# EAGLE design gpsdo (EAGLE 8.2.2)
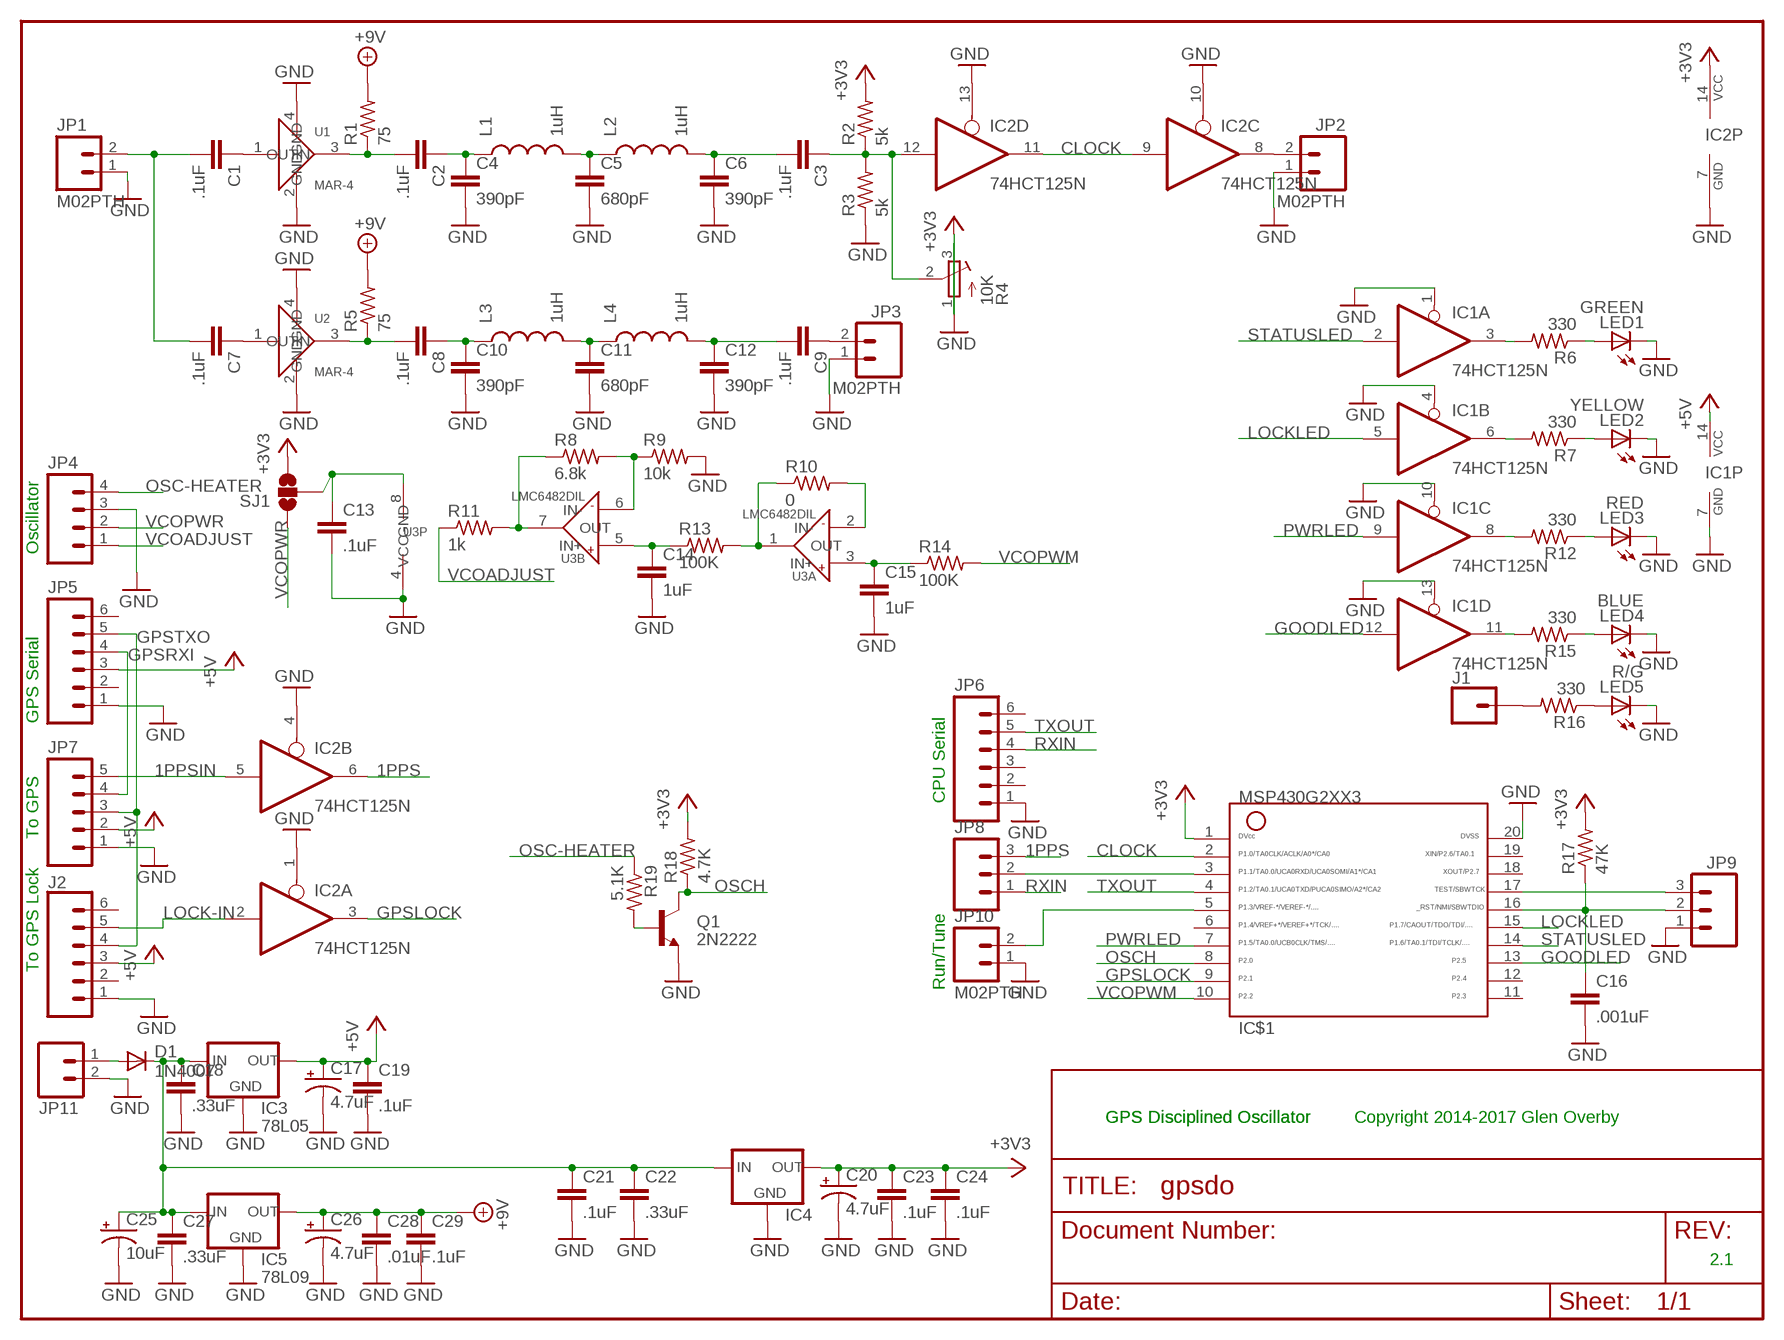
[diagram p0: schematic, sheet 1]

## Parts
C1  .1uF  CAPPTH  [CAP-PTH-SMALL]
C2  .1uF  CAPPTH  [CAP-PTH-SMALL]
C3  .1uF  CAPPTH  [CAP-PTH-SMALL]
C4  390pF  CAPPTH  [CAP-PTH-SMALL]
C5  680pF  CAPPTH  [CAP-PTH-SMALL]
C6  390pF  CAPPTH  [CAP-PTH-SMALL]
C7  .1uF  CAPPTH  [CAP-PTH-SMALL]
C8  .1uF  CAPPTH  [CAP-PTH-SMALL]
C9  .1uF  CAPPTH  [CAP-PTH-SMALL]
C10  390pF  CAPPTH  [CAP-PTH-SMALL]
C11  680pF  CAPPTH  [CAP-PTH-SMALL]
C12  390pF  CAPPTH  [CAP-PTH-SMALL]
C13  .1uF  CAPPTH1  [CAP-PTH-5MM]
C14  1uF  CAPPTH  [CAP-PTH-SMALL]
C15  1uF  CAPPTH  [CAP-PTH-SMALL]
C16  .001uF  CAPPTH  [CAP-PTH-SMALL]
C17  4.7uF  10UF-16V-10%(TANT)  [EIA3216]
C18  .33uF  CAPPTH  [CAP-PTH-SMALL]
C19  .1uF  CAPPTH  [CAP-PTH-SMALL]
C20  4.7uF  10UF-16V-10%(TANT)  [EIA3216]
C21  .1uF  CAPPTH  [CAP-PTH-SMALL]
C22  .33uF  CAPPTH  [CAP-PTH-SMALL]
C23  .1uF  CAPPTH  [CAP-PTH-SMALL]
C24  .1uF  CAPPTH  [CAP-PTH-SMALL]
C25  10uF  CAP_POLPTH2  [CPOL-RADIAL-10UF-25V]
C26  4.7uF  10UF-16V-10%(TANT)  [EIA3216]
C27  .33uF  CAPPTH  [CAP-PTH-SMALL]
C28  .01uF  CAPPTH  [CAP-PTH-SMALL]
C29  .1uF  CAPPTH  [CAP-PTH-SMALL]
D1  1N4007  DIODEPTH  [DIODE-1N4001]
IC1  74HCT125N  [DIL14]
IC2  74HCT125N  74LS125N  [DIL14]
IC3  78L05  V_REG_78XXSINK  [TO220-IGO]
IC4  78LXX  [78LXX]
IC5  78L09  78LXX  [78LXX]
IC$1  G2XX3---N20  [N20]
J1  CONN_01  [1X01]
J2  CONN_06SILK_FEMALE_PTH  [1X06]
JP1  M02PTH  [1X02]
JP2  M02PTH  [1X02]
JP3  M02PTH  [1X02]
JP4  M04PTH  [1X04@1]
JP5  M06SILK_FEMALE_PTH  [1X06@1]
JP6  M06SILK_FEMALE_PTH  [1X06@1]
JP7  M05PTH  [1X05]
JP8  M03PTH  [1X03]
JP9  M03PTH  [1X03]
JP10  M02PTH  [1X02]
JP11  M02PTH  [1X02]
L1  1uH  INDUCTOR1210  [1210]
L2  1uH  INDUCTOR1210  [1210]
L3  1uH  INDUCTOR1210  [1210]
L4  1uH  INDUCTOR1210  [1210]
LED1  GREEN  LED3MM  [LED3MM]
LED2  YELLOW  LED3MM  [LED3MM]
LED3  RED  LED3MM  [LED3MM]
LED4  BLUE  LED3MM  [LED3MM]
LED5  R/G  LED3MM  [LED3MM]
Q1  2N2222  TRANSISTOR_NPNTO92  [TO-92]
R1  75  R-US_0207/2V  [0207/2V]
R2  5k  R-US_0207/2V  [0207/2V]
R3  5k  R-US_0207/2V  [0207/2V]
R4  10K  R-TRIMM3296W  [RTRIM3296W]
R5  75  R-US_0207/2V  [0207/2V]
R6  330  R-US_0207/2V  [0207/2V]
R7  330  R-US_0207/2V  [0207/2V]
R8  6.8k  R-US_0207/2V  [0207/2V]
R9  10k  R-US_0207/2V  [0207/2V]
R10  0  R-US_0207/2V  [0207/2V]
R11  1k  R-US_0207/2V  [0207/2V]
R12  330  R-US_0207/2V  [0207/2V]
R13  100K  R-US_0207/2V  [0207/2V]
R14  100K  R-US_0207/2V  [0207/2V]
R15  330  R-US_0207/2V  [0207/2V]
R16  330  R-US_0207/2V  [0207/2V]
R17  47K  R-US_0207/2V  [0207/2V]
R18  4.7K  R-US_0207/2V  [0207/2V]
R19  5.1K  R-US_0207/2V  [0207/2V]
SJ1  SOLDERJUMPER_2WAYW  [SJ_2W]
U1  MAR-4  [VV105]
U2  MAR-4  [VV105]
U3  LMC6482DIL  [DIL08]

## Nets
1PPS: IC2.6(B:O) JP8.3
1PPSIN: IC2.5(B:I) JP7.5
+3V3: C20.A(+) C23.1 C24.1 IC2.14(P:VCC) IC4.OUT IC$1.1 R2.2 R4.1(A) R17.2 R18.2 SJ1.3
+5V: C17.A(+) C19.1 IC1.14(P:VCC) IC3.OUT J2.3 JP5.3 JP7.2
+9V: C26.A(+) C28.1 C29.1 IC5.OUT R1.2 R5.2
CLOCK: IC2.9(C:I) IC2.11(D:O) IC$1.2
GND: C4.2 C5.2 C6.2 C10.2 C11.2 C12.2 C13.2 C14.2 C15.2 C16.2 C17.C(-) C18.2 C19.2 C20.C(-) C21.2 C22.2 C23.2 C24.2 C25.2(-) C26.C(-) C27.2 C28.2 C29.2 IC1.1(A:OE) IC1.4(B:OE) IC1.7(P:GND) IC1.10(C:OE) IC1.13(D:OE) IC2.1(A:OE) IC2.4(B:OE) IC2.7(P:GND) IC2.10(C:OE) IC2.13(D:OE) IC3.GND IC4.GND IC5.GND IC$1.20 J2.1 JP1.1 JP2.1 JP3.1 JP4.3 JP5.1 JP6.1 JP7.1 JP9.1 JP10.1 JP11.2 LED1.K(C) LED2.K(C) LED3.K(C) LED4.K(C) LED5.K(C) Q1.1(E) R3.1 R4.3(E) R9.2 U1.2(GND) U1.4(GND) U2.2(GND) U2.4(GND) U3.4(P:GND)
GOODLED: IC1.12(D:I) IC$1.13
GPSLOCK: IC2.3(A:O) IC$1.9
GPSRXI: JP5.4 JP7.4
GPSTXO: J2.4 JP5.5 JP7.3
LOCK-IN: IC2.2(A:I) J2.5
LOCKLED: IC1.5(B:I) IC$1.15
N$1: LED2.A R7.1
N$2: C5.1 L1.2 L2.1
N$3: C3.2 C6.1 L2.2
N$4: C1.1 U1.1(IN)
N$5: C14.1 R13.1 U3.5(B:IN+)
N$6: R10.1 R13.2 U3.1(A:OUT)
N$7: C15.1 R14.1 U3.3(A:IN+)
N$9: IC$1.3 JP8.2
N$10: C2.2 R1.1 U1.3(OUT)
N$11: C3.1 IC2.12(D:I) R2.1 R3.2 R4.2(S)
N$12: LED1.A R6.1
N$13: R8.1 R11.2 U3.7(B:OUT)
N$14: C1.2 C7.2 JP1.2
N$15: R10.2 U3.2(A:IN-)
N$16: C11.1 L3.2 L4.1
N$17: D1.A JP11.1
N$18: C9.2 C12.1 L4.2
N$19: IC$1.5 JP10.2
N$20: IC1.8(C:O) R12.2
N$21: IC1.11(D:O) R15.2
N$22: C8.2 R5.1 U2.3(OUT)
N$23: C16.1 IC$1.16 JP9.2 R17.1
N$24: C8.1 C10.1 L3.1
N$25: C7.1 U2.1(IN)
N$26: C9.1 JP3.2
N$27: IC$1.17 JP9.3
N$28: LED5.A R16.1
N$29: J1.1 R16.2
N$30: IC2.8(C:O) JP2.2
N$31: C13.1 SJ1.2 U3.8(P:VCC)
N$33: C2.1 C4.1 L1.1
N$35: IC1.3(A:O) R6.2
N$36: IC1.6(B:O) R7.2
N$37: R8.2 R9.1 U3.6(B:IN-)
N$39: LED3.A R12.1
N$40: LED4.A R15.1
N$41: Q1.2(B) R19.2
OSC-HEATER: JP4.4 R19.1
OSCH: IC$1.8 Q1.3(C) R18.1
PWRIN: C18.1 C21.1 C22.1 C25.1(+) C27.1 D1.C IC3.IN IC4.IN IC5.IN
PWRLED: IC1.9(C:I) IC$1.7
RXIN: JP6.4 JP8.1
STATUSLED: IC1.2(A:I) IC$1.14
TXOUT: IC$1.4 JP6.5
VCOADJUST: JP4.1 R11.1
VCOPWM: IC$1.10 R14.2
VCOPWR: JP4.2 SJ1.1
Unconnected: IC$1.6 IC$1.11 IC$1.12 IC$1.18 IC$1.19 J2.2 J2.6 JP5.2 JP5.6 JP6.2 JP6.3 JP6.6

## Notes on the sheet
- Oscillator
- GPS Serial
- CPU Serial
- To GPS
- To GPS Lock
- Run/Tune
- GPS Disciplined Oscillator | GPS Disciplined Oscillator | Copyright 2014-2017 Glen Overby
- 2.1

## Library data of the parts
C1-C3 C7-C9 = SparkFun:CAP: Capacitor Standard 0603 ceramic capacitor, and 0.1" leaded capacitor.
C4-C6 C10-C12 = zener:CAP: Capacitor Standard 0603 ceramic capacitor, and 0.1" leaded capacitor.
C13 C16 C18 C19 C21-C24 C27-C29 = SparkFun-Capacitors:CAP: Capacitor Standard 0603 ceramic capacitor, and 0.1" leaded capacitor.
C14 C15 = SparkFun-Passives:CAP: Capacitor Standard 0603 ceramic capacitor, and 0.1" leaded capacitor.
C17 C20 C26 = SparkFun-Capacitors:10UF-16V-10%(TANT): CAP-00811 1206/EIA-3216 Tantalum capacitor; PROD_ID: CAP-00811; VALUE: 10uF
C25 = SparkFun-Passives:CAP_POL: Capacitor Polarized These are standard SMD and PTH capacitors. Normally 10uF, 47uF, and 100uF in electrolytic and tantalum varieties. Always verify the external diameter of the through hole cap, it varies with capacity, voltage, and manufacturer. The EIA devices should be standard.
D1 = SparkFun:DIODE: Diode These are standard reverse protection diodes and small signal diodes. SMA package can handle up to about 1A. SOD-323 can handle about 200mA. What the SOD-323 package when ordering, there are some mfgs out there that are 5-pin packages.
IC1 = 74xx-eu:74*125: Quad bus BUFFER, 3-state
IC2 = 74xx-us:74*125: Quad bus BUFFER, 3-state
IC3 = SparkFun:V_REG_78XX: Voltage Regulator Standard 7805 5V regulator. IGO (Input Ground Output). Spark Fun Electronics SKU : COM-00107
IC4 IC5 = v-reg:78LXX: VOLTAGE REGULATOR
IC$1 = TI_MSP430_v16:G2XX3---N20: MSP430G2XX1 PDIP (N) 20 Pin Package
J1 = SparkFun-Connectors:CONN_01: Single connection point. Often used as Generic Header-pin footprint for 0.1 inch spaced/style header connections On any of the 0.1 inch spaced packages, you can populate with these: Break Away Headers - Straight <https://www.sparkfun.com/products/116> (PRT-00116) Break Away Male Headers - Right Angle <https://www.sparkfun.com/products/553> (PRT-00553) Female Headers <https://www.sparkfun.com/products/115> (PRT-00115) Break Away Headers - Machine Pin <https://www.sparkfun.com/products/117> (PRT-00117) Break Away Female Headers - Swiss Machine Pin <https://www.sparkfun.com/products/743> (PRT-00743) This device is also useful as a general connection point to wire up your design to another part of your project. Our various solder wires solder well into these plated through hole pads. Hook-Up Wire - Assortment (Stranded, 22 AWG) <https://www.sparkfun.com/products/11375> (PRT-11375) Hook-Up Wire - Assortment (Solid Core, 22 AWG) <https://www.sparkfun.com/products/11367> (PRT-11367) View the entire wire category on our website here <https://www.sparkfun.com/categories/141> Special notes: SMTSO-256-ET is a "flush mount" nut for a 4-40 screw. We mostly use this on specialty testbeds; it is a nice way to connect hardware to your PCB at an adjustable hieght. Also note, the SNAP packages are for using a snappable style connector. We sell a baggie of snaps and they are also used on two LilyPad designs: Snap Assortment - 30 pack (male and female) <https://www.sparkfun.com/products/11347> (DEV-11347) LilyPad Arduino SimpleSnap <https://www.sparkfun.com/products/10941> (DEV-10941) LilyPad SimpleSnap Protoboard <https://www.sparkfun.com/products/10940> (DEV-10940)
J2 = SparkFun-Connectors:CONN_06: Multi connection point. Often used as Generic Header-pin footprint for 0.1 inch spaced/style header connections On any of the 0.1 inch spaced packages, you can populate with these: Break Away Headers - Straight <https://www.sparkfun.com/products/116> (PRT-00116) Break Away Male Headers - Right Angle <https://www.sparkfun.com/products/553> (PRT-00553) Female Headers <https://www.sparkfun.com/products/115> (PRT-00115) Break Away Headers - Machine Pin <https://www.sparkfun.com/products/117> (PRT-00117) Break Away Female Headers - Swiss Machine Pin <https://www.sparkfun.com/products/743> (PRT-00743) Arduino Stackable Header - 6 Pin <https://www.sparkfun.com/products/9280> (PRT-09280) For SCREWTERMINALS and SPRING TERMINALS visit here: Screw Terimnals on SparkFun.com <https://www.sparkfun.com/search/results?term=Screw+Terminals> (5mm/3.5mm/2.54mm spacing) This device is also useful as a general connection point to wire up your design to another part of your project. Our various solder wires solder well into these plated through hole pads. Hook-Up Wire - Assortment (Stranded, 22 AWG) <https://www.sparkfun.com/products/11375> (PRT-11375) Hook-Up Wire - Assortment (Solid Core, 22 AWG) <https://www.sparkfun.com/products/11367> (PRT-11367) View the entire wire category on our website here <https://www.sparkfun.com/categories/141>; PROD_ID: CONN-08437
JP1-JP3 JP10 = SparkFun-Connectors:M02: Standard 2-pin 0.1" header. Use with - straight break away headers ( PRT-00116) - right angle break away headers (PRT-00553) - swiss pins (PRT-00743) - machine pins (PRT-00117) - female headers (PRT-00115) Molex polarized connector foot print use with: PRT-08233 with associated crimp pins and housings. 2.54_SCREWTERM for use with PRT-10571. 3.5mm Screw Terminal footprints for PRT-08084 5mm Screw Terminal footprints for use with PRT-08432
JP4 = SparkFun-Connectors:M04: Header 4 Standard 4-pin 0.1" header. Use with straight break away headers (SKU : PRT-00116), right angle break away headers (PRT-00553), swiss pins (PRT-00743), machine pins (PRT-00117), and female headers (PRT-00115). Molex polarized connector foot print use with SKU : PRT-08231 with associated crimp pins and housings. 1MM SMD Version SKU: PRT-10208
JP5 JP6 = SparkFun-Connectors:M06: Header 6 Standard 6-pin 0.1" header. Use with straight break away headers (SKU : PRT-00116), right angle break away headers (PRT-00553), swiss pins (PRT-00743), machine pins (PRT-00117), and female headers (PRT-00115). Molex polarized connector foot print use with SKU : PRT-08094 with associated crimp pins and housings. NOTES ON THE VARIANTS LOCK and LOCK_LONGPADS... This footprint was designed to help hold the alignment of a through-hole component (i.e. 6-pin header) while soldering it into place. You may notice that each hole has been shifted either up or down by 0.005 of an inch from it's more standard position (which is a perfectly straight line). This slight alteration caused the pins (the squares in the middle) to touch the edges of the holes. Because they are alternating, it causes a "brace" to hold the component in place. 0.005 has proven to be the perfect amount of "off-center" position when using our standard breakaway headers. Although looks a little odd when you look at the bare footprint, once you have a header in there, the alteration is very hard to notice. Also,if you push a header all the way into place, it is covered up entirely on the bottom side. This idea of altering the position of holes to aid alignment will be further integrated into the Sparkfun Library for other footprints. It can help hold any component with 3 or more connection pins.; PROD_ID: CONN-08437
JP7 = SparkFun:M05: Header 5 Standard 5-pin 0.1" header. Use with straight break away headers (SKU : PRT-00116), right angle break away headers (PRT-00553), swiss pins (PRT-00743), machine pins (PRT-00117), and female headers (PRT-00115). Molex polarized connector foot print use with SKU : PRT-08230 with associated crimp pins and housings.
JP8 JP9 = SparkFun:M03: Header 3 Standard 3-pin 0.1" header. Use with straight break away headers (SKU : PRT-00116), right angle break away headers (PRT-00553), swiss pins (PRT-00743), machine pins (PRT-00117), and female headers (PRT-00115). Molex polarized connector foot print use with SKU : PRT-08232 with associated crimp pins and housings.
JP11 = SparkFun:M02: Header 2 Standard 2-pin 0.1" header. Use with straight break away headers (SKU : PRT-00116), right angle break away headers (PRT-00553), swiss pins (PRT-00743), machine pins (PRT-00117), and female headers (PRT-00115). Molex polarized connector foot print use with SKU : PRT-08233 with associated crimp pins and housings.
L1-L4 = SparkFun-Passives:INDUCTOR: Inductors Basic Inductor/Choke - 0603 and 1206. Footprints are not proven and vary greatly between part numbers. SRN6045- 33uH, 20% 1.4A SDR0403-560KL - 56uH, 10%, 500mA RMS/740mA peak
LED1-LED5 = led:LED: LED OSRAM: - CHIPLED LG R971, LG N971, LY N971, LG Q971, LY Q971, LO R971, LY R971 LH N974, LH R974 LS Q976, LO Q976, LY Q976 LO Q996 - Hyper CHIPLED LW Q18S LB Q993, LB Q99A, LB R99A - SideLED LS A670, LO A670, LY A670, LG A670, LP A670 LB A673, LV A673, LT A673, LW A673 LH A674 LY A675 LS A676, LA A676, LO A676, LY A676, LW A676 LS A679, LY A679, LG A679 - Hyper Micro SIDELED® LS Y876, LA Y876, LO Y876, LY Y876 LT Y87S - SmartLED LW L88C, LW L88S LB L89C, LB L89S, LG L890 LS L89K, LO L89K, LY L89K LS L896, LA L896, LO L896, LY L896 - TOPLED LS T670, LO T670, LY T670, LG T670, LP T670 LSG T670, LSP T670, LSY T670, LOP T670, LYG T670 LG T671, LOG T671, LSG T671 LB T673, LV T673, LT T673, LW T673 LH T674 LS T676, LA T676, LO T676, LY T676, LB T676, LH T676, LSB T676, LW T676 LB T67C, LV T67C, LT T67C, LS T67K, LO T67K, LY T67K, LW E67C LS E67B, LA E67B, LO E67B, LY E67B, LB E67C, LV E67C, LT E67C LW T67C LS T679, LY T679, LG T679 LS T770, LO T770, LY T770, LG T770, LP T770 LB T773, LV T773, LT T773, LW T773 LH T774 LS E675, LA E675, LY E675, LS T675 LS T776, LA T776, LO T776, LY T776, LB T776 LHGB T686 LT T68C, LB T68C - Hyper Mini TOPLED® LB M676 - Mini TOPLED Santana® LG M470 LS M47K, LO M47K, LY M47K Source: http://www.osram.convergy.de LUXEON: - LUMILED® LXK2-PW12-R00, LXK2-PW12-S00, LXK2-PW14-U00, LXK2-PW14-V00 LXK2-PM12-R00, LXK2-PM12-S00, LXK2-PM14-U00 LXK2-PE12-Q00, LXK2-PE12-R00, LXK2-PE12-S00, LXK2-PE14-T00, LXK2-PE14-U00 LXK2-PB12-K00, LXK2-PB12-L00, LXK2-PB12-M00, LXK2-PB14-N00, LXK2-PB14-P00, LXK2-PB14-Q00 LXK2-PR12-L00, LXK2-PR12-M00, LXK2-PR14-Q00, LXK2-PR14-R00 LXK2-PD12-Q00, LXK2-PD12-R00, LXK2-PD12-S00 LXK2-PH12-R00, LXK2-PH12-S00 LXK2-PL12-P00, LXK2-PL12-Q00, LXK2-PL12-R00 Source: www.luxeon.com KINGBRIGHT: KA-3528ASYC Source: www.kingbright.com
Q1 = SparkFun:TRANSISTOR_NPN: Transistor NPN BJT configuration in SOT23 package. MMBT2222 is the common NPN we use. Double check BCE configuration again layout.
R1-R3 R5-R19 = resistor:R-US_: RESISTOR, American symbol
R4 = resistor:R-TRIMM: Trimm resistor
SJ1 = SparkFun-Passives:SOLDERJUMPER_2WAY: Solder Jumper 2 way solder jumper
U1 U2 = LTC3200:MAR-4: MAR-4 is a MMIC with 8dB of gain to 1GHZ
U3 = overby:LMC6482: Dual Op-Amp

## Board
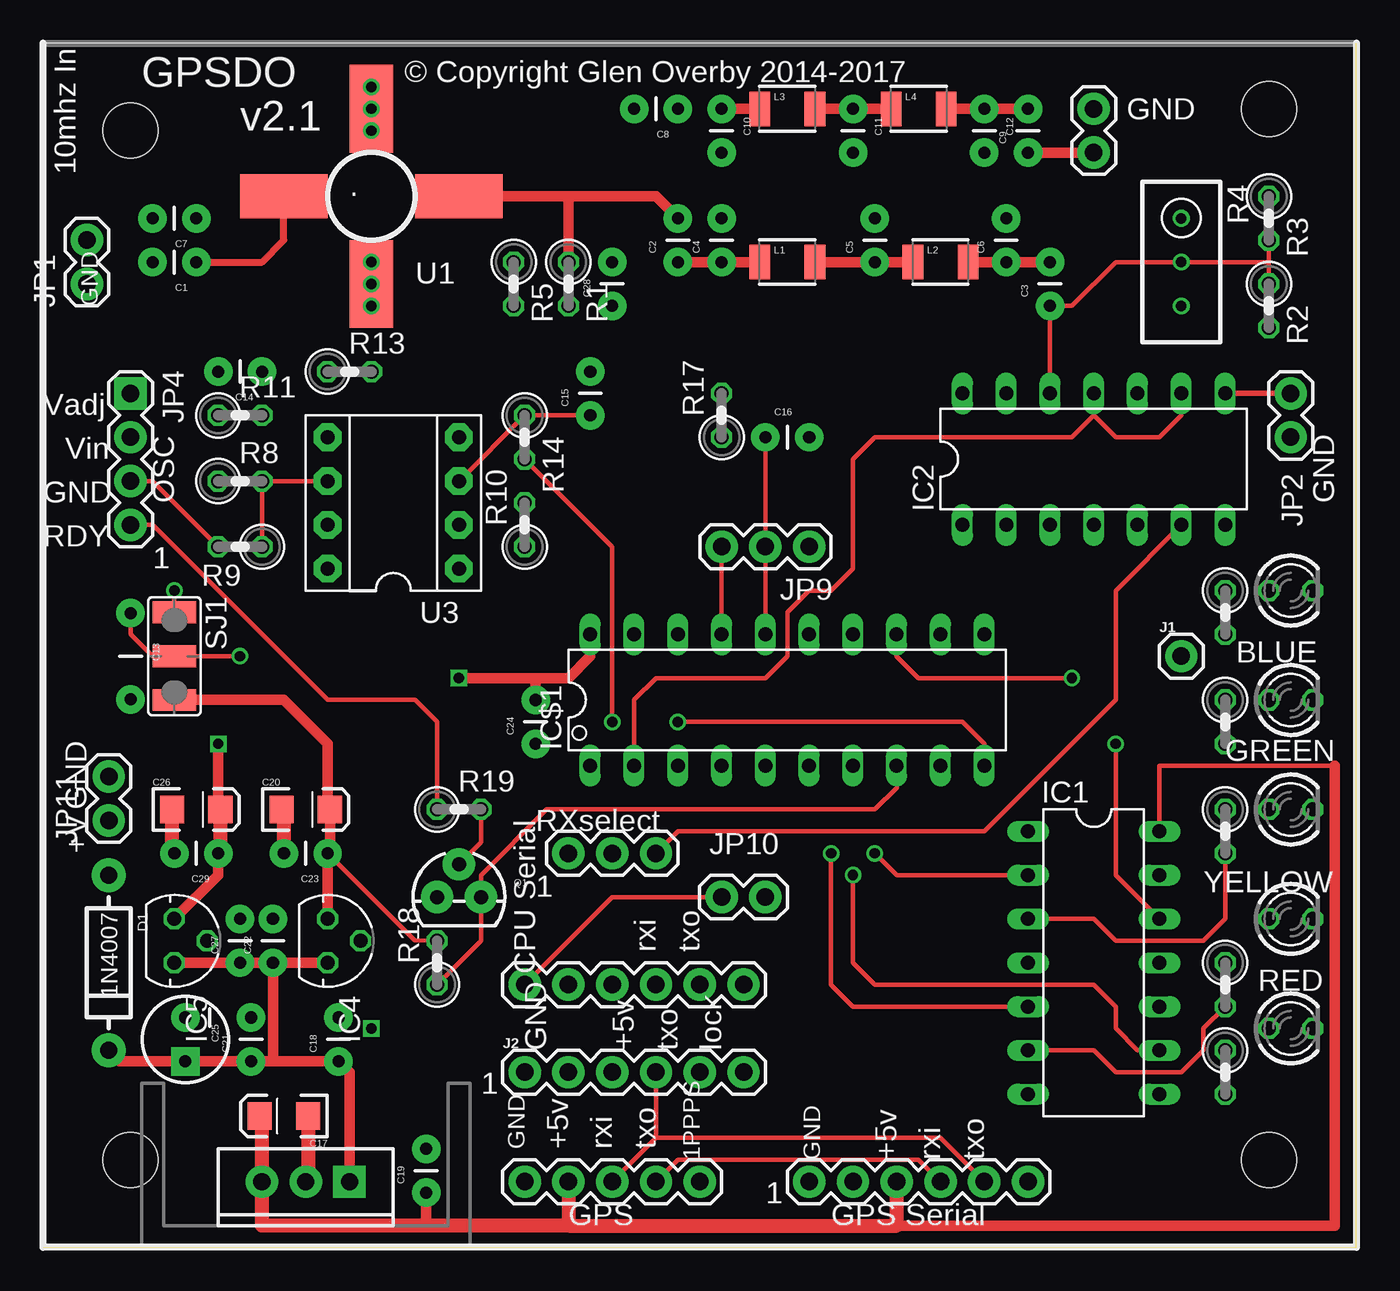
[diagram p1: board, top side]
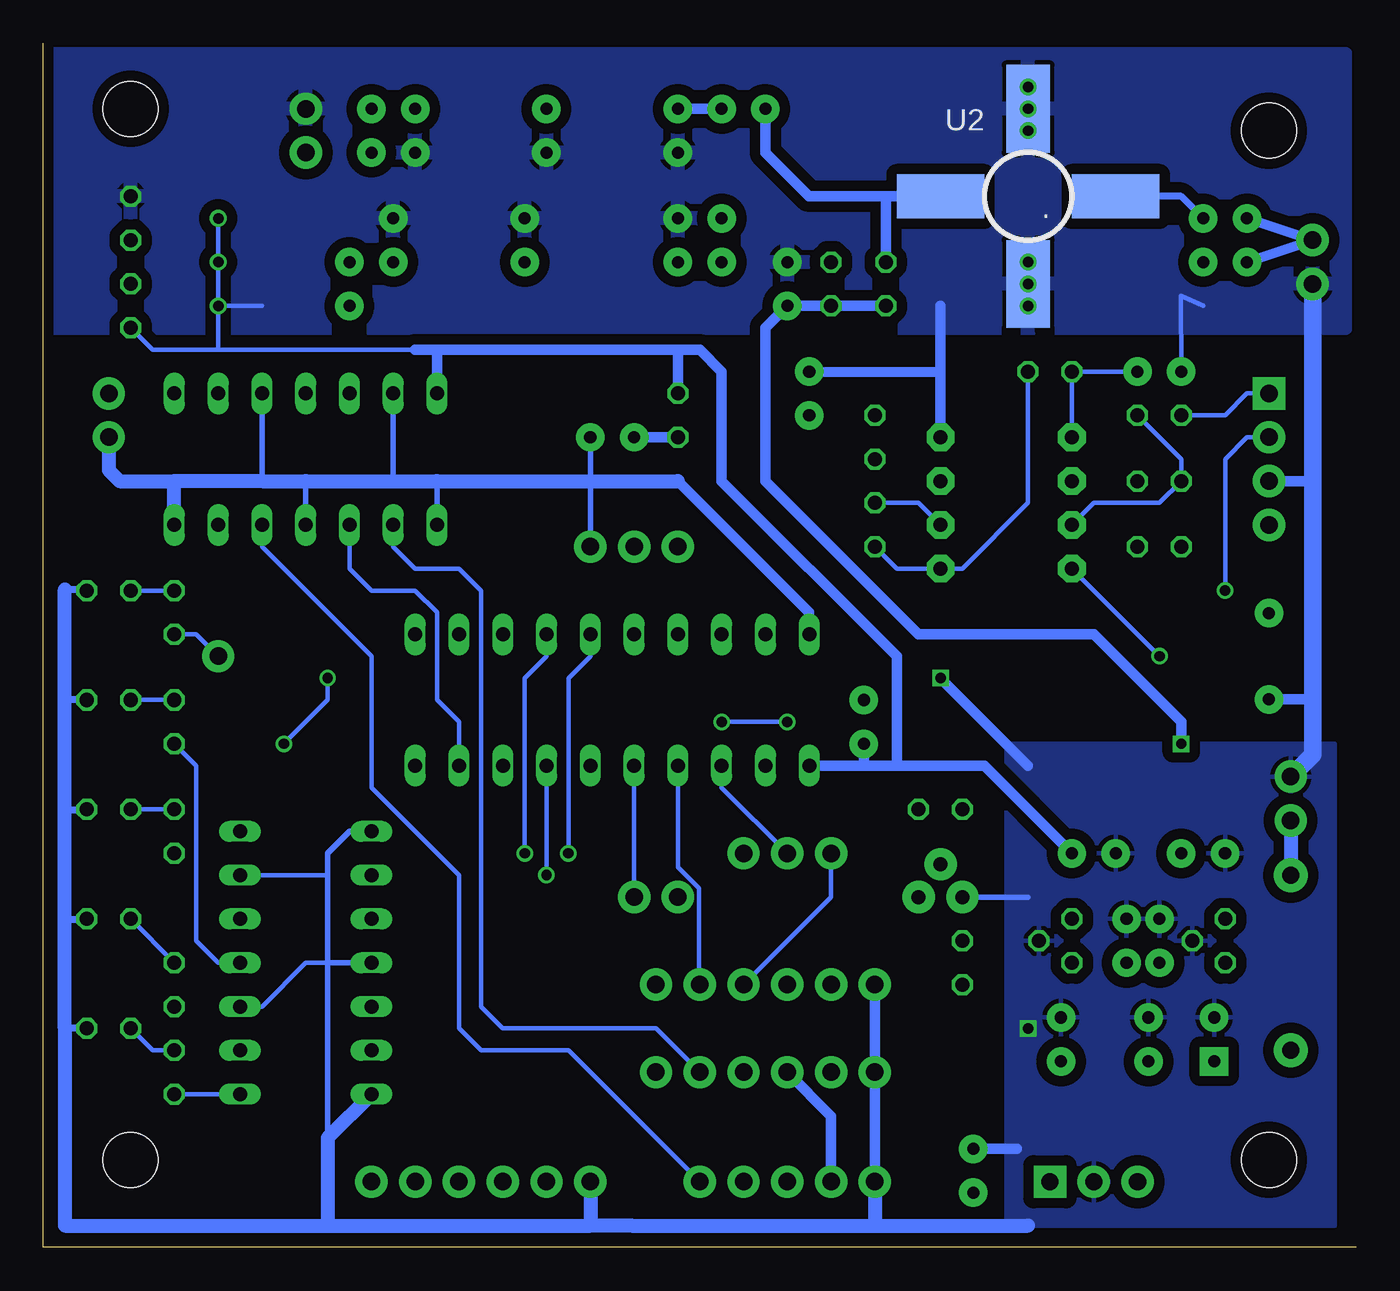
[diagram p2: board, bottom side, seen from below]

Size 76.2 x 69.85 mm. Coordinates in mm from the lower left corner, seen from the top.
Outline: 0,0 76.2,0 76.2,69.85
Copper layers (1*16): Top 0.0356mm / dielectric 1.5011mm / Bottom 0.0356mm
Design rules "LaenPCBOrder": minimum track width 6mil, minimum drill 13mil, track to track 6mil, track to pad 6mil, pad to pad 6mil, via to via 6mil, smd to smd 6mil, copper to edge 15mil, drill to drill 6mil, minimum pad ring 7mil, minimum via ring 7mil, stop-mask expansion 3mil, vias tented up to drill 0mil, thermal gap 10mil
Holes 3.17 mm at 71.12,66.04 5.08,5.08 71.12,5.08 5.08,64.77

### Footprints (pad centres in the part's own frame; a part is rotated, then mirrored left to right if it is on the bottom)
CAP-PTH-SMALL = drill 0.7 pad 1.651: 1 0,0; 2 2.54,0
CAP-PTH-5MM = drill 0.7 pad 1.651: 1 -2.5,0; 2 2.5,0
EIA3216 = smd 1.4 x 1.6: A 1.4,0; C -1.4,0
CPOL-RADIAL-10UF-25V = drill 0.7 pad 1.651 square: 1 1.27,0 | drill 0.7 pad 1.651: 2 -1.27,0
DIODE-1N4001 = drill 1 pad 1.981: A -5.08,0; C 5.08,0
DIL14 = drill 0.813 long: 1 -7.62,-3.81; 2 -5.08,-3.81; 3 -2.54,-3.81; 4 0,-3.81; 5 2.54,-3.81; 6 5.08,-3.81; 7 7.62,-3.81; 8 7.62,3.81; 9 5.08,3.81; 10 2.54,3.81; 11 0,3.81; 12 -2.54,3.81; 13 -5.08,3.81; 14 -7.62,3.81
TO220-IGO = drill 1 pad 1.88: GND 0,0; OUT 2.54,0 | drill 1 pad 1.88 square: IN -2.54,0
78LXX = drill 0.813 octagon: GND 0,1.905; IN 1.27,0; OUT -1.27,0
N20 = drill 0.813 long: 1 -11.435,-3.81; 2 -8.895,-3.81; 3 -6.355,-3.81; 4 -3.815,-3.81; 5 -1.275,-3.81; 6 1.265,-3.81; 7 3.805,-3.81; 8 6.345,-3.81; 9 8.885,-3.81; 10 11.425,-3.81; 11 11.425,3.81; 12 8.885,3.81; 13 6.345,3.81; 14 3.805,3.81; 15 1.265,3.81; 16 -1.275,3.81; 17 -3.815,3.81; 18 -6.355,3.81; 19 -8.895,3.81; 20 -11.435,3.81
1X01 = drill 1.016 pad 1.88: 1 0,0
1X06 = drill 1.016 pad 1.88: 1 0,0; 2 2.54,0; 3 5.08,0; 4 7.62,0; 5 10.16,0; 6 12.7,0
1X02 = drill 1.016 pad 1.88: 1 0,0; 2 2.54,0
1X04@1 = drill 1.016 pad 1.88 square: 1 0,0 | drill 1.016 pad 1.88: 2 2.54,0; 3 5.08,0; 4 7.62,0
1X06@1 = drill 1.016 pad 1.88: 1 0,0; 2 2.54,0; 3 5.08,0; 4 7.62,0; 5 10.16,0; 6 12.7,0
1X05 = drill 1.016 pad 1.88: 1 0,0; 2 2.54,0; 3 5.08,0; 4 7.62,0; 5 10.16,0
1X03 = drill 1.016 pad 1.88: 1 0,0; 2 2.54,0; 3 5.08,0
1210 = smd 1.2 x 2: 1 -1.6,0; 2 1.6,0
LED3MM = drill 0.813 octagon: A -1.27,0; K 1.27,0
TO-92 = drill 0.813 pad 1.88: 1 -1.27,0; 2 0,1.905; 3 1.27,0
0207/2V = drill 0.813 octagon: 1 -1.27,0; 2 1.27,0
RTRIM3296W = drill 0.61: 1 0,-2.54; 2 0,0; 3 0,2.54
SJ_2W = smd 1.27 x 2.54: 1 -2.54,0; 2 0,0; 3 2.54,0
VV105 = smd 5.08 x 2.54: 1 -5.08,0; 3 5.08,0 | smd 2.54 x 5.08: 2 0,-5.08; 4 0,5.08
DIL08 = drill 0.813 pad 1.6 octagon: 1 -3.81,-3.81; 2 -1.27,-3.81; 3 1.27,-3.81; 4 3.81,-3.81; 5 3.81,3.81; 6 1.27,3.81; 7 -1.27,3.81; 8 -3.81,3.81

### Placement (x,y rotation side)
C1  8.89,57.15 180 top
C2  36.83,57.15 90 top
C3  58.42,54.61 90 top
C4  39.37,57.15 90 top
C5  48.26,57.15 90 top
C6  55.88,57.15 90 top
C7  8.89,59.69 180 top
C8  36.83,66.04 180 top
C9  57.15,63.5 90 top
C10  39.37,66.04 270 top
C11  46.99,66.04 270 top
C12  54.61,66.04 270 top
C13  5.08,34.29 270 top
C14  12.7,50.8 180 top
C15  31.75,48.26 90 top
C16  41.91,46.99 0 top
C17  13.97,7.62 180 top
C18  17.14,10.79 90 top
C19  22.23,3.17 90 top
C20  15.24,25.4 0 top
C21  12.06,10.79 90 top
C22  13.34,16.51 90 top
C23  16.51,22.86 180 top
C24  28.57,29.21 90 top
C25  8.26,12.06 270 top
C26  8.89,25.4 0 top
C27  11.43,16.51 90 top
C28  33.02,54.61 90 top
C29  10.16,22.86 180 top
D1  3.81,16.51 270 top
IC1  60.96,16.51 270 top
IC2  60.96,45.72 0 top
IC3  15.24,3.81 180 top
IC4  16.51,17.78 270 top
IC5  7.62,17.78 270 top
IC$1  43.18,31.75 0 top
J1  66.04,34.29 0 top
J2  27.94,10.16 0 top
JP1  2.54,55.88 90 top
JP2  72.39,46.99 90 top
JP3  60.96,66.04 270 top
JP4  5.08,49.53 270 top
JP5  44.45,3.81 0 top
JP6  27.94,15.24 0 top
JP7  27.94,3.81 0 top
JP8  30.48,22.86 0 top
JP9  44.45,40.64 180 top
JP10  39.37,20.32 0 top
JP11  3.81,24.77 90 top
L1  43.18,57.15 0 top
L2  52.07,57.15 0 top
L3  43.18,66.04 0 top
L4  50.8,66.04 0 top
LED1  72.39,25.4 0 top
LED2  72.39,19.05 0 top
LED3  72.39,12.7 0 top
LED4  72.39,31.75 0 top
LED5  72.39,38.1 0 top
Q1  24.13,20.32 0 top
R1  30.48,55.88 270 top
R2  71.12,54.61 270 top
R3  71.12,59.69 270 top
R4  66.04,57.15 180 top
R5  27.3,55.88 270 top
R6  68.58,24.13 270 top
R7  68.58,15.24 270 top
R8  11.43,44.45 0 top
R9  11.43,40.64 180 top
R10  27.94,41.91 90 top
R11  11.43,48.26 0 top
R12  68.58,10.16 270 top
R13  17.78,50.8 0 top
R14  27.94,46.99 270 top
R15  68.58,30.48 270 top
R16  68.58,36.83 270 top
R17  39.37,48.26 90 top
R18  22.86,16.51 90 top
R19  24.13,25.4 0 top
SJ1  7.62,34.29 270 top
U1  19.05,60.96 0 top
U2  19.05,60.96 180 bottom
U3  20.32,43.18 90 top

### Tracks (layer width: path | path; a pad name or v marks a point on that pad's centre or on a via)
1PPS
  Top 0.254: JP8.3 36.83,24.13 54.61,24.13 62.23,31.75 62.23,38.1 IC2.6
1PPSIN
  Bottom 0.254: IC2.5 63.5,40.64 57.15,34.29 57.15,26.67 52.07,21.59 52.07,12.7 50.8,11.43 45.72,11.43 JP7.5
+3V3
  Top 0.254: R18.2 21.59,17.82 21.55,17.82 C23.1
  Top 0.61: SJ1.3 13.97,31.75 16.51,29.21 16.51,25.4 C20.A 16.64,22.99 C23.1 IC4.OUT
  Bottom 0.254: 54.61,52.07 66.04,52.07 | 66.04,52.07 69.85,52.07 R2.2 | R4.1 66.04,52.07
  Bottom 0.61: IC$1.1 28.57,27.94 | 28.57,27.94 26.67,27.94 | 26.67,27.94 21.59,27.94 C23.1 | 39.37,52.07 38.1,52.07 36.83,50.8 36.83,44.45 26.67,34.29 26.67,27.94 | 39.37,52.07 53.34,52.07 | 53.34,52.07 54.61,52.07 | IC2.14 53.34,52.07 | 39.37,52.07 R17.2 | C24.1 28.57,27.94
+5V
  Top 0.254: IC1.14 64.77,27.94 74.93,27.94
  Top 0.61: 74.93,27.94 74.93,1.27 49.53,1.27 | C19.1 22.23,1.27
  Top 0.813: 30.48,1.27 49.53,1.27 JP5.3 | JP7.2 30.48,1.27 | 12.7,7.75 C17.A 12.7,7.49 IC3.OUT 12.7,1.27 22.23,1.27 30.48,1.27
  Bottom 0.61: J2.3 30.48,7.62 JP7.2
+9V  (via drill 0.6)
  Top 0.61: v10.16,29.21 10.16,25.53 C26.A | IC5.OUT 10.16,21.59 C29.1
  Top 0.813: C29.1 10.29,22.99 C26.A
  Bottom 0.61: v10.16,29.21 10.16,30.48 15.24,35.56 25.4,35.56 34.29,44.45 34.29,53.34 C28.1 R1.2 R5.2
CLOCK
  Top 0.254: 60.96,48.26 59.69,46.99 48.26,46.99 46.99,45.72 46.99,39.37 45.72,38.1 44.45,38.1 43.18,36.83 43.18,34.29 41.91,33.02 35.56,33.02 34.29,31.75 IC$1.2 | IC2.11 60.96,48.26 | 60.96,48.26 62.23,46.99 64.77,46.99 66.04,48.26 IC2.9
GND  (via drill 0.6)
  Top 0.254: JP4.3 6.35,44.45 R9.2 | JP10.1 33.02,20.32 JP6.1
  Top 0.61: IC$1.20 31.75,34.28 30.48,33.02 28.57,33.02 | 28.57,33.02 v24.13,33.02 | 28.57,33.02 C24.2
  Top 0.813: C17.C 15.37,3.94 IC3.GND | C29.2 7.49,22.99 C26.C | C20.C 13.97,25.27 C23.2
  Bottom 0.254: IC1.13 59.69,21.59 | C14.2 10.2,55.2 8.89,54.61 | IC1.10 63.5,13.97 60.96,16.51 59.69,16.51 | 41.91,1.42 42.06,1.27 | R4.3 63.5,54.61
  Bottom 0.305: IC2.10 63.5,44.45 | IC2.4 60.96,44.45 | IC2.13 55.88,44.45 | C16.2 44.45,44.45 JP9.1 | IC2.1 53.34,44.45 | Q1.1 19.05,20.32 | IC1.1 58.42,24.13 59.69,22.86 59.69,21.59 59.69,16.51 | 59.69,16.51 59.69,5.08 | IC1.4 59.69,16.51
  Bottom 0.406: LED5.K 73.72,38.16 74.93,38.16 | LED4.K 74.93,31.76 | LED1.K 73.71,25.35 74.93,25.35 | LED2.K 73.7,19.01 74.93,19.01 | LED3.K 74.93,12.7
  Bottom 0.61: JP4.3 2.54,44.45 | v24.13,33.02 19.05,27.94 | 39.37,44.45 31.75,36.83 IC$1.20 | U3.4 24.13,50.8 | 24.13,50.8 24.13,54.61 | C13.2 2.58,31.79 2.54,33.02 | C19.2 19.68,5.71 | C15.2 24.17,50.76 24.13,50.8 | JP6.1 J2.1 JP7.1
  Bottom 0.813: IC2.7 68.58,44.45 | 68.58,44.45 63.5,44.45 60.96,44.45 55.88,44.45 53.34,44.45 44.45,44.45 39.37,44.45 | 74.93,38.16 74.93,31.76 74.93,25.35 74.93,19.01 74.93,12.7 74.93,1.27 59.69,1.27 | 59.69,1.27 44.45,1.27 | 44.45,1.27 42.06,1.27 27.94,1.27 | JP5.1 44.45,1.27 | IC1.7 59.69,6.35 59.69,5.08 59.69,1.27 | JP7.1 27.94,1.27 | 27.94,1.27 19.05,1.27 | JP2.1 72.39,45.09 71.75,44.45 68.58,44.45
  Bottom 1.016: JP11.2 2.54,28.57 2.54,33.02 2.54,44.45 JP1.1
  other vias: 19.05,67.31 19.05,55.88 19.05,66.04 19.05,64.77 19.05,57.15 19.05,54.61 19.05,12.7
  pour Bottom (isolate 0.61): 1.27,1.27 1.27,29.21 20.32,29.21 20.32,1.27
  pour Bottom (isolate 0.61): 0.64,69.22 75.56,69.22 75.56,53.34 0.64,53.34
GOODLED  (via drill 0.6)
  Top 0.254: IC$1.13 49.52,34.3 50.8,33.02 v59.69,33.02 | v62.23,29.21 62.23,21.59 IC1.12
  Bottom 0.254: v59.69,33.02 59.69,31.75 v62.23,29.21
GPSLOCK
  Bottom 0.254: IC$1.9 52.06,30.48 53.34,31.75 53.34,36.83 54.61,38.1 57.15,38.1 58.42,39.37 IC2.3
GPSRXI
  Top 0.254: JP7.4 36.83,5.08 50.8,5.08 JP5.4
GPSTXO
  Top 0.254: JP5.5 52.07,6.35 46.99,6.35 | 35.56,6.35 JP7.3 | 46.99,6.35 35.56,6.35 | 46.99,6.35 | J2.4 35.56,6.35
LOCK-IN
  Bottom 0.254: IC2.2 55.88,40.64 54.61,39.37 52.07,39.37 50.8,38.1 50.8,13.97 49.53,12.7 40.64,12.7 J2.5
LOCKLED  (via drill 0.6)
  Top 0.254: v45.72,22.86 45.72,15.24 46.99,13.97 IC1.5
  Bottom 0.254: IC$1.15 44.45,34.3 45.72,33.02 v45.72,22.86
N$1
  Bottom 0.254: R7.1 LED2.A
N$2
  Top 0.61: L1.2 C5.1 L2.1
N$3
  Top 0.61: L2.2 C6.1 C3.2
N$4
  Top 0.406: C1.1 12.7,57.15 13.97,58.42 U1.1
N$5
  Bottom 0.254: U3.5 R13.1 C14.1
N$6
  Bottom 0.254: R13.2 19.05,43.18 22.86,39.37 U3.1 26.67,39.37 R10.1
N$7
  Top 0.254: C15.1 R14.1 U3.3
N$9
  Bottom 0.254: IC$1.3 36.83,26.66 JP8.2
N$10
  Top 0.61: U1.3 30.48,60.96 | 30.48,60.96 35.56,60.96 C2.2 | R1.1 30.48,60.96
N$11
  Top 0.254: IC2.12 C3.1 59.69,54.61 62.23,57.15 R4.2 71.12,57.15 | 71.12,57.15 R3.2 | R2.1 71.12,57.15
N$12
  Bottom 0.254: R6.1 LED1.A
N$13
  Bottom 0.254: R11.2 10.16,45.72 R8.1 11.43,43.18 15.24,43.18 U3.7
N$14
  Bottom 0.61: C7.2 JP1.2 C1.2
N$15
  Bottom 0.254: R10.2 25.4,43.18 U3.2
N$16
  Top 0.61: L3.2 C11.1 L4.1
N$17
  Bottom 0.813: JP11.1 D1.A
N$18
  Top 0.61: L4.2 C12.1 C9.2
N$19
  Bottom 0.254: IC$1.5 JP10.2
N$20
  Bottom 0.254: IC1.8 R12.2
N$21
  Bottom 0.254: IC1.11 66.04,16.51 67.31,17.78 67.31,27.94 R15.2
N$22
  Bottom 0.61: U2.3 27.3,60.96 | 27.3,60.96 31.75,60.96 34.29,63.5 C8.2 | R5.1 27.3,60.96
N$23
  Top 0.254: C16.1 JP9.2 IC$1.16
  Bottom 0.61: R17.1 C16.1
N$24
  Top 0.61: L3.1 C10.1
  Bottom 0.61: C10.1 C8.1
N$25
  Bottom 0.406: C7.1 10.16,60.96 U2.1
N$26
  Top 0.61: C9.1 JP3.2
N$27
  Top 0.254: JP9.3 IC$1.17
N$28
  Bottom 0.254: R16.1 LED5.A
N$29
  Bottom 0.254: R16.2 67.31,35.56 J1.1
N$30
  Top 0.305: IC2.8 JP2.2
N$31  (via drill 0.6)
  Top 0.254: C13.1 5.08,35.56 6.35,34.29 SJ1.2 v11.43,34.29
  Bottom 0.254: U3.8 v11.43,34.29
N$33
  Top 0.61: C2.1 C4.1 L1.1
N$35
  Top 0.254: IC1.3 60.96,19.05 62.23,17.78 67.31,17.78 68.58,19.05 R6.2
N$36
  Top 0.254: IC1.6 60.96,11.43 62.23,10.16 66.04,10.16 67.31,11.43 67.31,12.7 R7.2
N$37
  Top 0.254: U3.6 R8.2 R9.1
N$39
  Bottom 0.254: LED3.A 69.85,11.43 R12.1
N$40
  Bottom 0.254: R15.1 LED4.A
N$41
  Top 0.254: Q1.2 25.4,23.5 R19.2
OSC-HEATER
  Top 0.254: JP4.4 6.35,41.91 16.51,31.75 21.59,31.75 22.86,30.48 R19.1
OSCH
  Top 0.254: IC$1.8 49.53,26.67 48.26,25.4 29.21,25.4 25.4,21.59 Q1.3 25.4,17.78 R18.1
PWRIN
  Top 0.61: D1.C 4.45,10.79 C25.1 C21.1 13.34,10.79 | IC4.IN C22.1 | IC5.IN C27.1 C22.1 | 13.34,10.79 C22.1 | 13.34,10.79 C18.1 17.78,10.16 IC3.IN
PWRLED  (via drill 0.6)
  Top 0.254: v46.99,21.59 46.99,16.51 48.26,15.24 60.96,15.24 62.23,13.97 62.23,12.7 63.5,11.43 IC1.9
  Bottom 0.254: IC$1.7 v46.98,21.59 v46.99,21.59
RXIN
  Bottom 0.254: JP6.4 30.48,20.32 JP8.1
STATUSLED  (via drill 0.6)
  Top 0.254: v48.26,22.86 49.53,21.59 IC1.2
  Bottom 0.254: IC$1.14 46.98,34.3 48.26,33.02 v48.26,22.86
TXOUT
  Bottom 0.254: IC$1.4 39.37,22.04 38.15,20.82 38.15,15.29 JP6.5
VCOADJUST
  Bottom 0.254: JP4.1 6.35,49.53 7.62,48.26 R11.1
VCOPWM  (via drill 0.6)
  Top 0.254: IC$1.10 54.6,29.21 53.34,30.48 v36.83,30.48 | v33.02,30.48 33.02,40.64 R14.2
  Bottom 0.254: v36.83,30.48 v33.02,30.48
VCOPWR  (via drill 0.6)
  Top 0.254: v7.62,38.1 SJ1.1
  Bottom 0.254: JP4.2 6.35,46.99 7.62,45.72 v7.62,38.1

### Text on the board
tPlace: © Copyright Glen Overby 2014-2017 | GPSDO | v2.1 | GND | 10mhz In | GND | Vadj | Vin | GND | OSC | GND | RDY | 1 | GND | RXselect | +V | 1 | rxi | txo | CPU Serial | GND | +5v | txo | lock | 1 | GND | +5v | rxi | txo | 1PPPS | GND | +5v | rxi | txo | 1 | GPS | GPS Serial
tDocu: 1 | 1